# Altium schematic sheet full_bridge_converter.SchDoc (part 1 of 3)
size A0; SheetNumber: 1; SheetTotal: 1
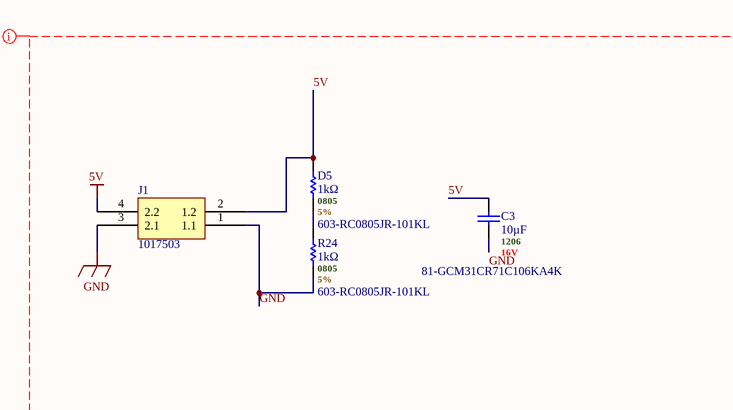
[diagram p0: full_bridge_converter.SchDoc, top left]
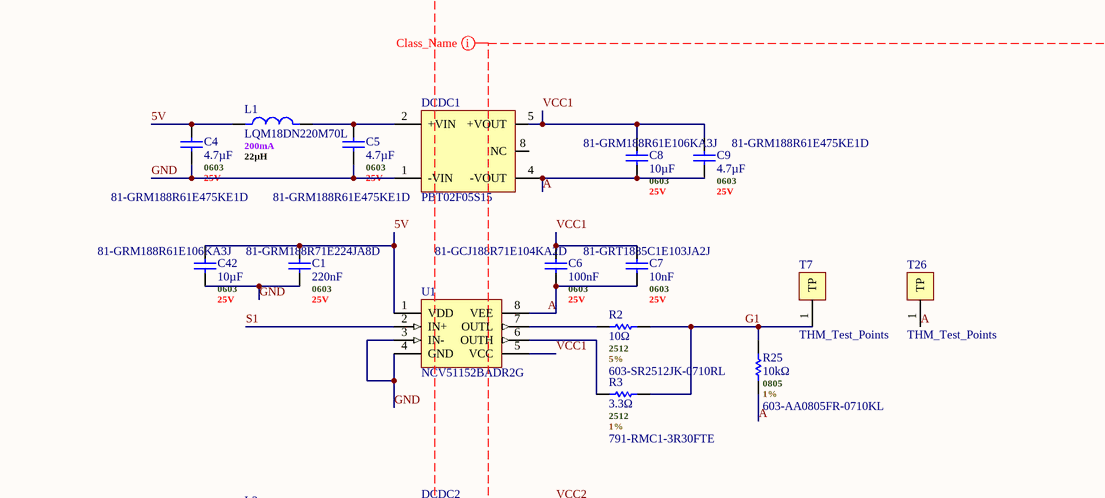
[diagram p1: full_bridge_converter.SchDoc, top right]
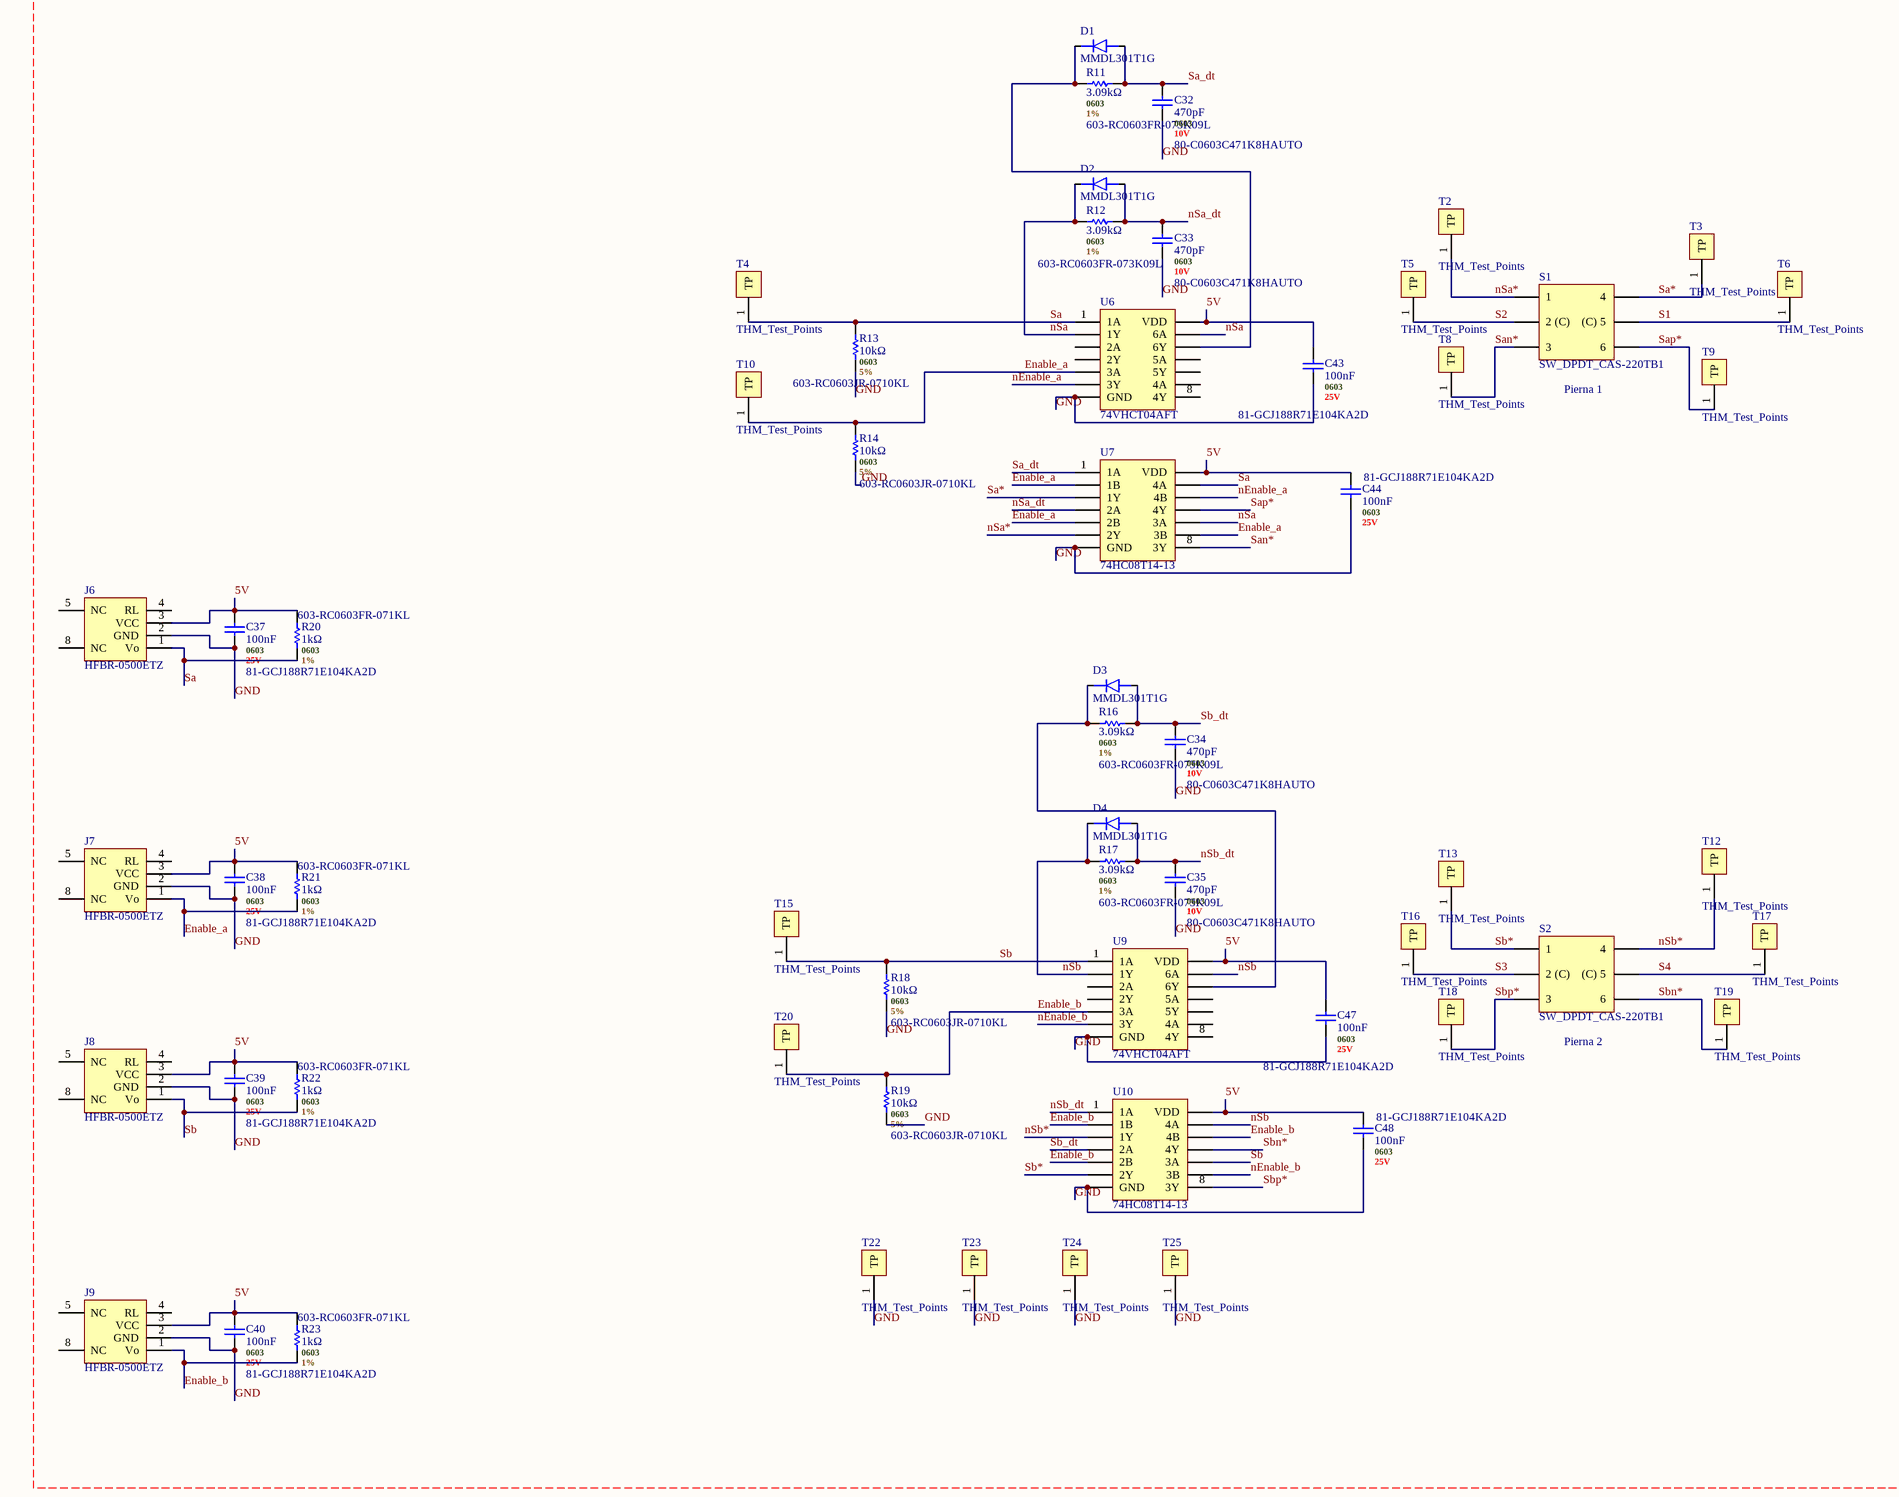
[diagram p2: full_bridge_converter.SchDoc, bottom left]
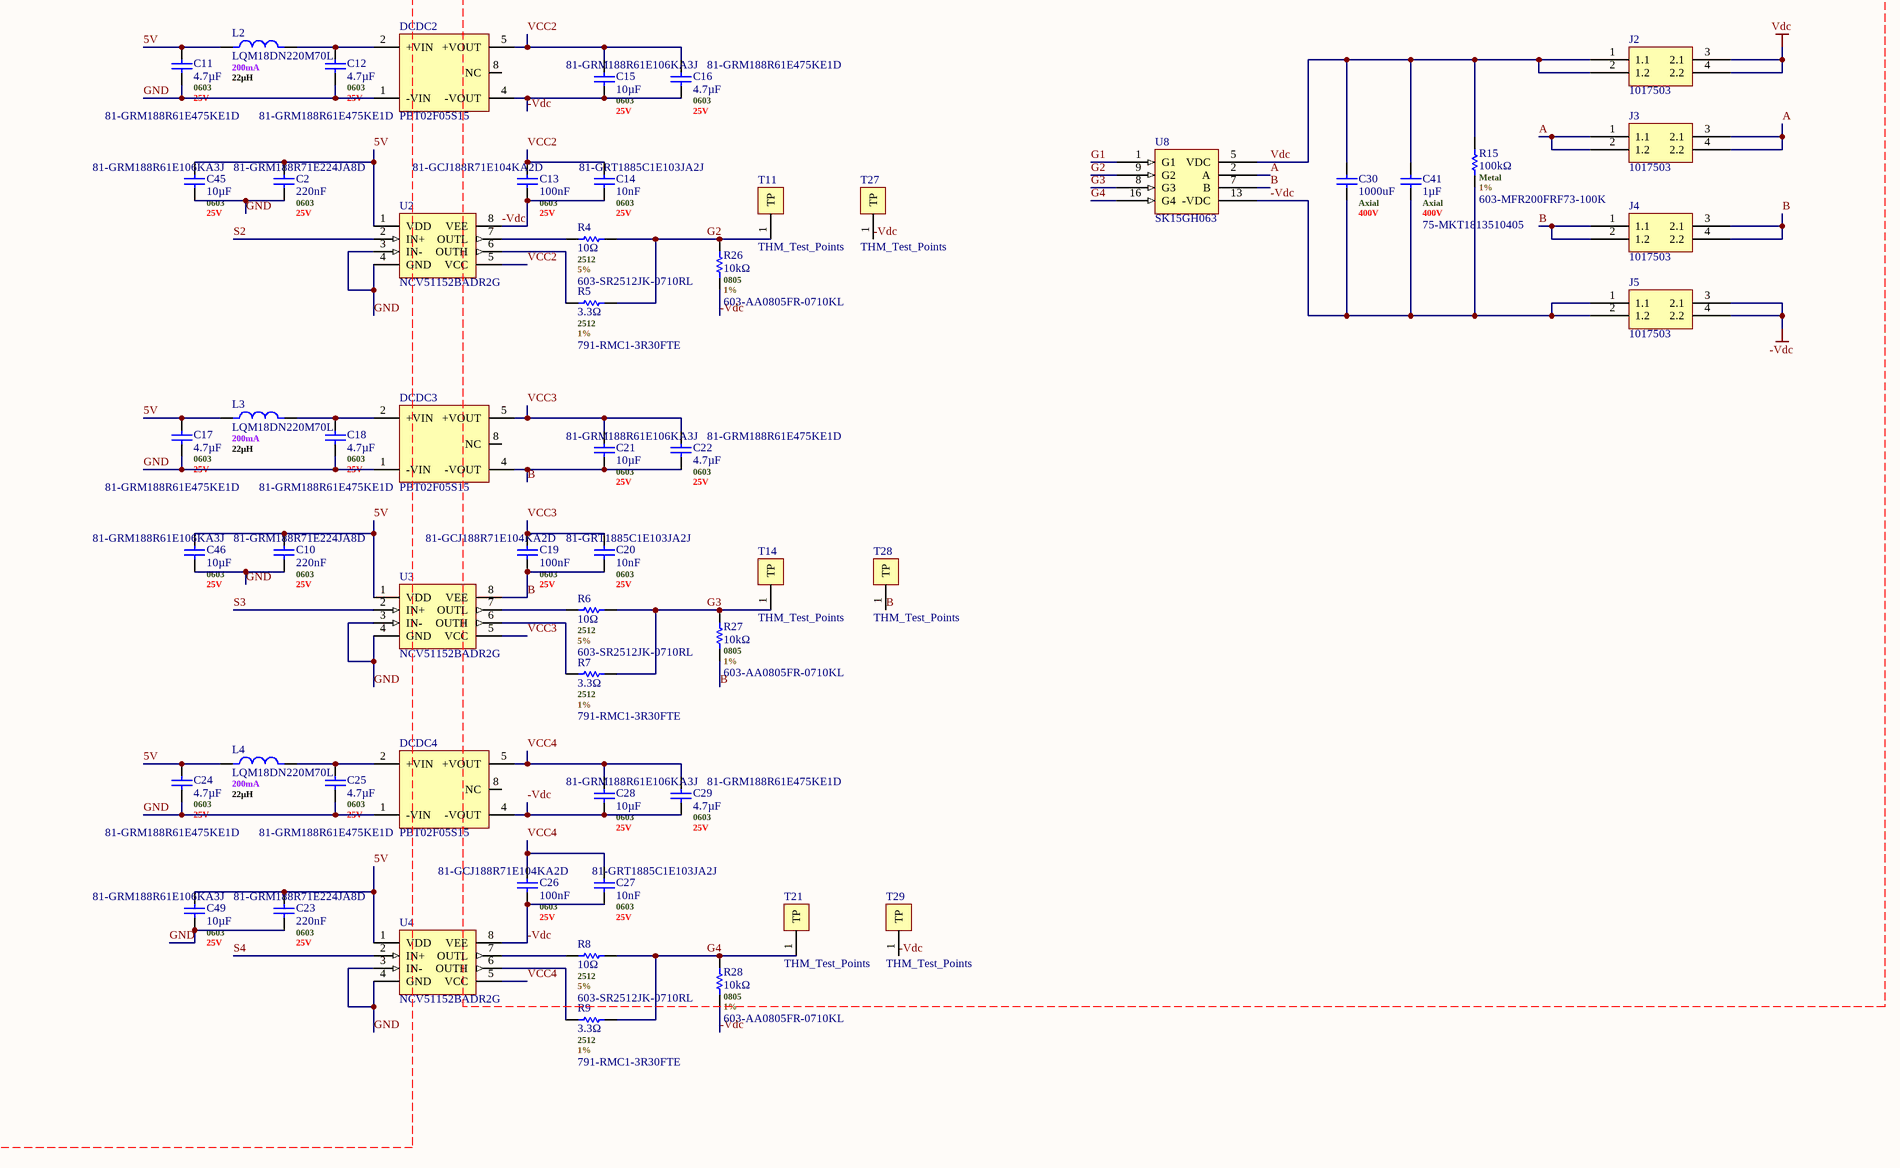
[diagram p3: full_bridge_converter.SchDoc, bottom right]

## Parts
C1  220nF  .Case/Package: 0603  .Voltage Rating (DC): 25V  Supplier Part Number 1: 81-GRM188R71E224JA8D  [GRM188R71E224JA88D]
C2  220nF  .Case/Package: 0603  .Voltage Rating (DC): 25V  Supplier Part Number 1: 81-GRM188R71E224JA8D  [GRM188R71E224JA88D]
C3  10µF  .Case/Package: 1206  .Voltage Rating (DC): 16V  Supplier Part Number 1: 81-GCM31CR71C106KA4K  [GCM31CR71C106KA64K]
C4  4.7µF  .Case/Package: 0603  .Voltage Rating (DC): 25V  Supplier Part Number 1: 81-GRM188R61E475KE1D  [GRM188R71E224JA88D]
C5  4.7µF  .Case/Package: 0603  .Voltage Rating (DC): 25V  Supplier Part Number 1: 81-GRM188R61E475KE1D  [GRM188R71E224JA88D]
C6  100nF  .Case/Package: 0603  .Voltage Rating (DC): 25V  Supplier Part Number 1: 81-GCJ188R71E104KA2D  [GRM188R71E224JA88D]
C7  10nF  .Case/Package: 0603  .Voltage Rating (DC): 25V  Supplier Part Number 1: 81-GRT1885C1E103JA2J  [GRM188R71E224JA88D]
C8  10µF  .Case/Package: 0603  .Voltage Rating (DC): 25V  Supplier Part Number 1: 81-GRM188R61E106KA3J  [GRM188R71E224JA88D]
C9  4.7µF  .Case/Package: 0603  .Voltage Rating (DC): 25V  Supplier Part Number 1: 81-GRM188R61E475KE1D  [GRM188R71E224JA88D]
C10  220nF  .Case/Package: 0603  .Voltage Rating (DC): 25V  Supplier Part Number 1: 81-GRM188R71E224JA8D  [GRM188R71E224JA88D]
C11  4.7µF  .Case/Package: 0603  .Voltage Rating (DC): 25V  Supplier Part Number 1: 81-GRM188R61E475KE1D  [GRM188R71E224JA88D]
C12  4.7µF  .Case/Package: 0603  .Voltage Rating (DC): 25V  Supplier Part Number 1: 81-GRM188R61E475KE1D  [GRM188R71E224JA88D]
C13  100nF  .Case/Package: 0603  .Voltage Rating (DC): 25V  Supplier Part Number 1: 81-GCJ188R71E104KA2D  [GRM188R71E224JA88D]
C14  10nF  .Case/Package: 0603  .Voltage Rating (DC): 25V  Supplier Part Number 1: 81-GRT1885C1E103JA2J  [GRM188R71E224JA88D]
C15  10µF  .Case/Package: 0603  .Voltage Rating (DC): 25V  Supplier Part Number 1: 81-GRM188R61E106KA3J  [GRM188R71E224JA88D]
C16  4.7µF  .Case/Package: 0603  .Voltage Rating (DC): 25V  Supplier Part Number 1: 81-GRM188R61E475KE1D  [GRM188R71E224JA88D]
C17  4.7µF  .Case/Package: 0603  .Voltage Rating (DC): 25V  Supplier Part Number 1: 81-GRM188R61E475KE1D  [GRM188R71E224JA88D]
C18  4.7µF  .Case/Package: 0603  .Voltage Rating (DC): 25V  Supplier Part Number 1: 81-GRM188R61E475KE1D  [GRM188R71E224JA88D]
C19  100nF  .Case/Package: 0603  .Voltage Rating (DC): 25V  Supplier Part Number 1: 81-GCJ188R71E104KA2D  [GRM188R71E224JA88D]
C20  10nF  .Case/Package: 0603  .Voltage Rating (DC): 25V  Supplier Part Number 1: 81-GRT1885C1E103JA2J  [GRM188R71E224JA88D]
C21  10µF  .Case/Package: 0603  .Voltage Rating (DC): 25V  Supplier Part Number 1: 81-GRM188R61E106KA3J  [GRM188R71E224JA88D]
C22  4.7µF  .Case/Package: 0603  .Voltage Rating (DC): 25V  Supplier Part Number 1: 81-GRM188R61E475KE1D  [GRM188R71E224JA88D]
C23  220nF  .Case/Package: 0603  .Voltage Rating (DC): 25V  Supplier Part Number 1: 81-GRM188R71E224JA8D  [GRM188R71E224JA88D]
C24  4.7µF  .Case/Package: 0603  .Voltage Rating (DC): 25V  Supplier Part Number 1: 81-GRM188R61E475KE1D  [GRM188R71E224JA88D]
C25  4.7µF  .Case/Package: 0603  .Voltage Rating (DC): 25V  Supplier Part Number 1: 81-GRM188R61E475KE1D  [GRM188R71E224JA88D]
C26  100nF  .Case/Package: 0603  .Voltage Rating (DC): 25V  Supplier Part Number 1: 81-GCJ188R71E104KA2D  [GRM188R71E224JA88D]
C27  10nF  .Case/Package: 0603  .Voltage Rating (DC): 25V  Supplier Part Number 1: 81-GRT1885C1E103JA2J  [GRM188R71E224JA88D]
C28  10µF  .Case/Package: 0603  .Voltage Rating (DC): 25V  Supplier Part Number 1: 81-GRM188R61E106KA3J  [GRM188R71E224JA88D]
C29  4.7µF  .Case/Package: 0603  .Voltage Rating (DC): 25V  Supplier Part Number 1: 81-GRM188R61E475KE1D  [GRM188R71E224JA88D]
C30  1000uF  .Case/Package: Axial  .Voltage Rating (DC): 400V  [1316N]
C32  470pF  .Case/Package: 0603  .Voltage Rating (DC): 10V  Supplier Part Number 1: 80-C0603C471K8HAUTO  [C0603 - MURATA]
C33  470pF  .Case/Package: 0603  .Voltage Rating (DC): 10V  Supplier Part Number 1: 80-C0603C471K8HAUTO  [C0603 - MURATA]
C34  470pF  .Case/Package: 0603  .Voltage Rating (DC): 10V  Supplier Part Number 1: 80-C0603C471K8HAUTO  [C0603 - MURATA]
C35  470pF  .Case/Package: 0603  .Voltage Rating (DC): 10V  Supplier Part Number 1: 80-C0603C471K8HAUTO  [C0603 - MURATA]
C37  100nF  .Case/Package: 0603  .Voltage Rating (DC): 25V  Supplier Part Number 1: 81-GCJ188R71E104KA2D  [GRM188R71E224JA88D]
C38  100nF  .Case/Package: 0603  .Voltage Rating (DC): 25V  Supplier Part Number 1: 81-GCJ188R71E104KA2D  [GRM188R71E224JA88D]
C39  100nF  .Case/Package: 0603  .Voltage Rating (DC): 25V  Supplier Part Number 1: 81-GCJ188R71E104KA2D  [GRM188R71E224JA88D]
C40  100nF  .Case/Package: 0603  .Voltage Rating (DC): 25V  Supplier Part Number 1: 81-GCJ188R71E104KA2D  [GRM188R71E224JA88D]
C41  1µF  .Case/Package: Axial  .Voltage Rating (DC): 400V  Supplier Part Number 1: 75-MKT1813510405  [MKT1813510405]
C42  10µF  .Case/Package: 0603  .Voltage Rating (DC): 25V  Supplier Part Number 1: 81-GRM188R61E106KA3J  [GRM188R71E224JA88D]
C43  100nF  .Case/Package: 0603  .Voltage Rating (DC): 25V  Supplier Part Number 1: 81-GCJ188R71E104KA2D  [GRM188R71E224JA88D]
C44  100nF  .Case/Package: 0603  .Voltage Rating (DC): 25V  Supplier Part Number 1: 81-GCJ188R71E104KA2D  [GRM188R71E224JA88D]
C45  10µF  .Case/Package: 0603  .Voltage Rating (DC): 25V  Supplier Part Number 1: 81-GRM188R61E106KA3J  [GRM188R71E224JA88D]
C46  10µF  .Case/Package: 0603  .Voltage Rating (DC): 25V  Supplier Part Number 1: 81-GRM188R61E106KA3J  [GRM188R71E224JA88D]
C47  100nF  .Case/Package: 0603  .Voltage Rating (DC): 25V  Supplier Part Number 1: 81-GCJ188R71E104KA2D  [GRM188R71E224JA88D]
C48  100nF  .Case/Package: 0603  .Voltage Rating (DC): 25V  Supplier Part Number 1: 81-GCJ188R71E104KA2D  [GRM188R71E224JA88D]
C49  10µF  .Case/Package: 0603  .Voltage Rating (DC): 25V  Supplier Part Number 1: 81-GRM188R61E106KA3J  [GRM188R71E224JA88D]
D1  MMDL301T1G  [DIOM2713X12N]
D2  MMDL301T1G  [DIOM2713X12N]
D3  MMDL301T1G  [DIOM2713X12N]
D4  MMDL301T1G  [DIOM2713X12N]
D5  1kΩ  .Case/Package: 0805  .Tolerance: 5%  Supplier Part Number 1: 603-RC0805JR-101KL  [RC0805JR-101KL]
DCDC1  PBT02F05S15  [PBT02F05S15]
DCDC2  PBT02F05S15  [PBT02F05S15]
DCDC3  PBT02F05S15  [PBT02F05S15]
DCDC4  PBT02F05S15  [PBT02F05S15]
J1  1017503  [CONN_1017491]
J2  1017503  [CONN_1017491]
J3  1017503  [CONN_1017491]
J4  1017503  [CONN_1017491]
J5  1017503  [CONN_1017491]
J6  HFBR-0500ETZ  [HFBR-0500ETZ]
J7  HFBR-0500ETZ  [HFBR-0500ETZ]
J8  HFBR-0500ETZ  [HFBR-0500ETZ]
J9  HFBR-0500ETZ  [HFBR-0500ETZ]
L1  LQM18DN220M70L  .RMS Current (Irms): 200mA  .Value: 22µH  [LQM18DN220M70L]
L2  LQM18DN220M70L  .RMS Current (Irms): 200mA  .Value: 22µH  [LQM18DN220M70L]
L3  LQM18DN220M70L  .RMS Current (Irms): 200mA  .Value: 22µH  [LQM18DN220M70L]
L4  LQM18DN220M70L  .RMS Current (Irms): 200mA  .Value: 22µH  [LQM18DN220M70L]
R2  10Ω  .Case/Package: 2512  .Tolerance: 5%  Supplier Part Number 1: 603-SR2512JK-0710RL  [SR2512JK-0710RL]
R3  3.3Ω  .Case/Package: 2512  .Tolerance: 1%  Supplier Part Number 1: 791-RMC1-3R30FTE  [RMC1-3R30FTE]
R4  10Ω  .Case/Package: 2512  .Tolerance: 5%  Supplier Part Number 1: 603-SR2512JK-0710RL  [SR2512JK-0710RL]
R5  3.3Ω  .Case/Package: 2512  .Tolerance: 1%  Supplier Part Number 1: 791-RMC1-3R30FTE  [RMC1-3R30FTE]
R6  10Ω  .Case/Package: 2512  .Tolerance: 5%  Supplier Part Number 1: 603-SR2512JK-0710RL  [SR2512JK-0710RL]
R7  3.3Ω  .Case/Package: 2512  .Tolerance: 1%  Supplier Part Number 1: 791-RMC1-3R30FTE  [RMC1-3R30FTE]
R8  10Ω  .Case/Package: 2512  .Tolerance: 5%  Supplier Part Number 1: 603-SR2512JK-0710RL  [SR2512JK-0710RL]
R9  3.3Ω  .Case/Package: 2512  .Tolerance: 1%  Supplier Part Number 1: 791-RMC1-3R30FTE  [RMC1-3R30FTE]
R11  3.09kΩ  .Case/Package: 0603  .Tolerance: 1%  Supplier Part Number 1: 603-RC0603FR-073K09L  [R0603 - YAGEO]
R12  3.09kΩ  .Case/Package: 0603  .Tolerance: 1%  Supplier Part Number 1: 603-RC0603FR-073K09L  [R0603 - YAGEO]
R13  10kΩ  .Case/Package: 0603  .Tolerance: 5%  Supplier Part Number 1: 603-RC0603JR-0710KL  [R0603 - YAGEO]
R14  10kΩ  .Case/Package: 0603  .Tolerance: 5%  Supplier Part Number 1: 603-RC0603JR-0710KL  [R0603 - YAGEO]
R15  100kΩ  .Case/Package: Metal  .Tolerance: 1%  Supplier Part Number 1: 603-MFR200FRF73-100K  [MFR200FRF73-100K]
R16  3.09kΩ  .Case/Package: 0603  .Tolerance: 1%  Supplier Part Number 1: 603-RC0603FR-073K09L  [R0603 - YAGEO]
R17  3.09kΩ  .Case/Package: 0603  .Tolerance: 1%  Supplier Part Number 1: 603-RC0603FR-073K09L  [R0603 - YAGEO]
R18  10kΩ  .Case/Package: 0603  .Tolerance: 5%  Supplier Part Number 1: 603-RC0603JR-0710KL  [R0603 - YAGEO]
R19  10kΩ  .Case/Package: 0603  .Tolerance: 5%  Supplier Part Number 1: 603-RC0603JR-0710KL  [R0603 - YAGEO]
R20  1kΩ  .Case/Package: 0603  .Tolerance: 1%  Supplier Part Number 1: 603-RC0603FR-071KL  [R0603 - YAGEO]
R21  1kΩ  .Case/Package: 0603  .Tolerance: 1%  Supplier Part Number 1: 603-RC0603FR-071KL  [R0603 - YAGEO]
R22  1kΩ  .Case/Package: 0603  .Tolerance: 1%  Supplier Part Number 1: 603-RC0603FR-071KL  [R0603 - YAGEO]
R23  1kΩ  .Case/Package: 0603  .Tolerance: 1%  Supplier Part Number 1: 603-RC0603FR-071KL  [R0603 - YAGEO]
R24  1kΩ  .Case/Package: 0805  .Tolerance: 5%  Supplier Part Number 1: 603-RC0805JR-101KL  [RC0805JR-101KL]
R25  10kΩ  .Case/Package: 0805  .Tolerance: 1%  Supplier Part Number 2: 603-AA0805FR-0710KL  [RC0805JR-101KL]
R26  10kΩ  .Case/Package: 0805  .Tolerance: 1%  Supplier Part Number 2: 603-AA0805FR-0710KL  [RC0805JR-101KL]
R27  10kΩ  .Case/Package: 0805  .Tolerance: 1%  Supplier Part Number 2: 603-AA0805FR-0710KL  [RC0805JR-101KL]
R28  10kΩ  .Case/Package: 0805  .Tolerance: 1%  Supplier Part Number 2: 603-AA0805FR-0710KL  [RC0805JR-101KL]
S1  SW_DPDT_CAS-220TB1  [CAS-220-TB1]
S2  SW_DPDT_CAS-220TB1  [CAS-220-TB1]
T2  THM_Test_Points  [Test_Point]
T3  THM_Test_Points  [Test_Point]
T4  THM_Test_Points  [Test_Point]
T5  THM_Test_Points  [Test_Point]
T6  THM_Test_Points  [Test_Point]
T7  THM_Test_Points  [Test_Point]
T8  THM_Test_Points  [Test_Point]
T9  THM_Test_Points  [Test_Point]
T10  THM_Test_Points  [Test_Point]
T11  THM_Test_Points  [Test_Point]
T12  THM_Test_Points  [Test_Point]
T13  THM_Test_Points  [Test_Point]
T14  THM_Test_Points  [Test_Point]
T15  THM_Test_Points  [Test_Point]
T16  THM_Test_Points  [Test_Point]
T17  THM_Test_Points  [Test_Point]
T18  THM_Test_Points  [Test_Point]
T19  THM_Test_Points  [Test_Point]
T20  THM_Test_Points  [Test_Point]
T21  THM_Test_Points  [Test_Point]
T22  THM_Test_Points  [Test_Point]
T23  THM_Test_Points  [Test_Point]
T24  THM_Test_Points  [Test_Point]
T25  THM_Test_Points  [Test_Point]
T26  THM_Test_Points  [Test_Point]
T27  THM_Test_Points  [Test_Point]
T28  THM_Test_Points  [Test_Point]
T29  THM_Test_Points  [Test_Point]
U1  NCV51152BADR2G  [SOIC-NCV51152BADR2G]
U2  NCV51152BADR2G  [SOIC-NCV51152BADR2G]
U3  NCV51152BADR2G  [SOIC-NCV51152BADR2G]
U4  NCV51152BADR2G  [SOIC-NCV51152BADR2G]
U6  74VHCT04AFT  [74VHCT04AFT]
U7  74HC08T14-13  [74HC08T14-13]
U8  SK15GH063  [SK15GH063]
U9  74VHCT04AFT  [74VHCT04AFT]
U10  74HC08T14-13  [74HC08T14-13]

## Nets
5V: C1.1 C2.1 C3.2 C4.2 C10.1 C11.2 C17.2 C23.1 C24.2 C37.1 C38.1 C39.1 C40.1 C42.2 C43.2 C44.2 C45.2 C46.2 C47.2 C48.2 C49.2 D5.2 J1.2(1.2) J1.4(2.2) J6.3(VCC) J7.3(VCC) J8.3(VCC) J9.3(VCC) L1.1 L2.1 L3.1 L4.1 R20.2 R21.2 R22.2 R23.2 U1.1(VDD) U2.1(VDD) U3.1(VDD) U4.1(VDD) U6.14(VDD) U7.14(VDD) U9.14(VDD) U10.14(VDD)
-Vdc: C13.1 C14.1 C15.1 C16.1 C26.1 C27.1 C28.1 C29.1 C30.V- C41.1 DCDC2.4(-VOUT) DCDC4.4(-VOUT) J5.1(1.1) J5.2(1.2) J5.3(2.1) J5.4(2.2) R15.1 R26.2 R28.2 T27.1(TP) T29.1(TP) U2.8(VEE) U4.8(VEE) U8.13(-VDC)
GND: C1.2 C2.2 C3.1 C4.1 C5.1 C10.2 C11.1 C12.1 C17.1 C18.1 C23.2 C24.1 C25.1 C32.1 C33.1 C34.1 C35.1 C37.2 C38.2 C39.2 C40.2 C42.1 C43.1 C44.1 C45.1 C46.1 C47.1 C48.1 C49.1 DCDC1.1(-VIN) DCDC2.1(-VIN) DCDC3.1(-VIN) DCDC4.1(-VIN) J1.1(1.1) J1.3(2.1) J6.2(GND) J7.2(GND) J8.2(GND) J9.2(GND) R13.1 R14.1 R18.1 R19.1 R24.1 T22.1(TP) T23.1(TP) T24.1(TP) T25.1(TP) U1.3(IN-) U1.4(GND) U2.3(IN-) U2.4(GND) U3.3(IN-) U3.4(GND) U4.3(IN-) U4.4(GND) U6.7(GND) U7.7(GND) U9.7(GND) U10.7(GND)
Vdc: C30.V+ C41.2 J2.1(1.1) J2.2(1.2) J2.3(2.1) J2.4(2.2) R15.2 U8.5(VDC)
A: C6.1 C7.1 C8.1 C9.1 DCDC1.4(-VOUT) J3.1(1.1) J3.2(1.2) J3.3(2.1) J3.4(2.2) R25.2 T26.1(TP) U1.8(VEE) U8.2(A)
B: C19.1 C20.1 C21.1 C22.1 DCDC3.4(-VOUT) J4.1(1.1) J4.2(1.2) J4.3(2.1) J4.4(2.2) R27.2 T28.1(TP) U3.8(VEE) U8.7(B)
Enable_a: J7.1(Vo) R14.2 R21.1 T10.1(TP) U6.5(3A) U7.2(1B) U7.5(2B) U7.9(3B)
Enable_b: J9.1(Vo) R19.2 R23.1 T20.1(TP) U9.5(3A) U10.2(1B) U10.5(2B) U10.12(4B)
G1: R2.2 R3.2 R25.1 T7.1(TP) U8.1(G1)
G2: R4.2 R5.2 R26.1 T11.1(TP) U8.9(G2)
G3: R6.2 R7.2 R27.1 T14.1(TP) U8.8(G3)
G4: R8.2 R9.2 R28.1 T21.1(TP) U8.16(G4)
nEnable_a: U6.6(3Y) U7.12(4B)
nEnable_b: U9.6(3Y) U10.9(3B)
nSa: D2.1 R12.2 U6.2(1Y) U6.13(6A) U7.10(3A)
nSa*: S1.1 T2.1(TP) U7.6(2Y)
nSa_dt: C33.2 D2.2 R12.1 U7.4(2A)
nSb: D4.1 R17.2 U9.2(1Y) U9.13(6A) U10.13(4A)
nSb*: S2.4 T12.1(TP) U10.3(1Y)
nSb_dt: C35.2 D4.2 R17.1 U10.1(1A)
S1: S1.5((C)_5) T6.1(TP) U1.2(IN+)
S2: S1.2(2_(C)) T5.1(TP) U2.2(IN+)
S3: S2.2(2_(C)) T16.1(TP) U3.2(IN+)
S4: S2.5((C)_5) T17.1(TP) U4.2(IN+)
Sa: J6.1(Vo) R13.2 R20.1 T4.1(TP) U6.1(1A) U7.13(4A)
Sa*: S1.4 T3.1(TP) U7.3(1Y)
Sa_dt: C32.2 D1.2 R11.1 U7.1(1A)
San*: S1.3 T8.1(TP) U7.8(3Y)
Sap*: S1.6 T9.1(TP) U7.11(4Y)
Sb: J8.1(Vo) R18.2 R22.1 T15.1(TP) U9.1(1A) U10.10(3A)
Sb*: S2.1 T13.1(TP) U10.6(2Y)
Sb_dt: C34.2 D3.2 R16.1 U10.4(2A)
Sbn*: S2.6 T19.1(TP) U10.11(4Y)
Sbp*: S2.3 T18.1(TP) U10.8(3Y)
VCC1: C6.2 C7.2 C8.2 C9.2 DCDC1.5(+VOUT) U1.5(VCC)
VCC2: C13.2 C14.2 C15.2 C16.2 DCDC2.5(+VOUT) U2.5(VCC)
VCC3: C19.2 C20.2 C21.2 C22.2 DCDC3.5(+VOUT) U3.5(VCC)
VCC4: C26.2 C27.2 C28.2 C29.2 DCDC4.5(+VOUT) U4.5(VCC)
NetC5_2: C5.2 DCDC1.2(+VIN) L1.2
NetC12_2: C12.2 DCDC2.2(+VIN) L2.2
NetC18_2: C18.2 DCDC3.2(+VIN) L3.2
NetC25_2: C25.2 DCDC4.2(+VIN) L4.2
NetD1_1: D1.1 R11.2 U6.12(6Y)
NetD3_1: D3.1 R16.2 U9.12(6Y)
NetD5_1: D5.1 R24.2
NetR2_1: R2.1 U1.7(OUTL)
NetR3_1: R3.1 U1.6(OUTH)
NetR4_1: R4.1 U2.7(OUTL)
NetR5_1: R5.1 U2.6(OUTH)
NetR6_1: R6.1 U3.7(OUTL)
NetR7_1: R7.1 U3.6(OUTH)
NetR8_1: R8.1 U4.7(OUTL)
NetR9_1: R9.1 U4.6(OUTH)

Not connected (* = marked no-connect by the designer): DCDC1 8(NC); DCDC2 8(NC); DCDC3 8(NC); DCDC4 8(NC); J6 4(RL) 5(NC) 8(NC); J7 4(RL) 5(NC) 8(NC); J8 4(RL) 5(NC) 8(NC); J9 4(RL) 5(NC) 8(NC); U6 3(2A) 4(2Y) 8(4Y) 9(4A) 10(5Y) 11(5A); U9 3(2A) 4(2Y) 8(4Y) 9(4A) 10(5Y) 11(5A)

## Layout directives
net class Power_Nets: -Vdc, A, B, G1, G2, G3, G4, VCC1, VCC2, VCC3, VCC4, Vdc
net class Control_Nets: 5V, Enable_a, Enable_b, GND, nEnable_a, nEnable_b, nSa, nSa*, nSa_dt, nSb, nSb*, nSb_dt, S1, S2, S3, S4, Sa, Sa*, Sa_dt, San*, Sap*, Sb, Sb*, Sb_dt, Sbn*, Sbp*

## Notes on the sheet
- (near S1) Pierna 1
- (near S2) Pierna 2